# Altium schematic sheet medusa-AI-power.SchDoc
size A
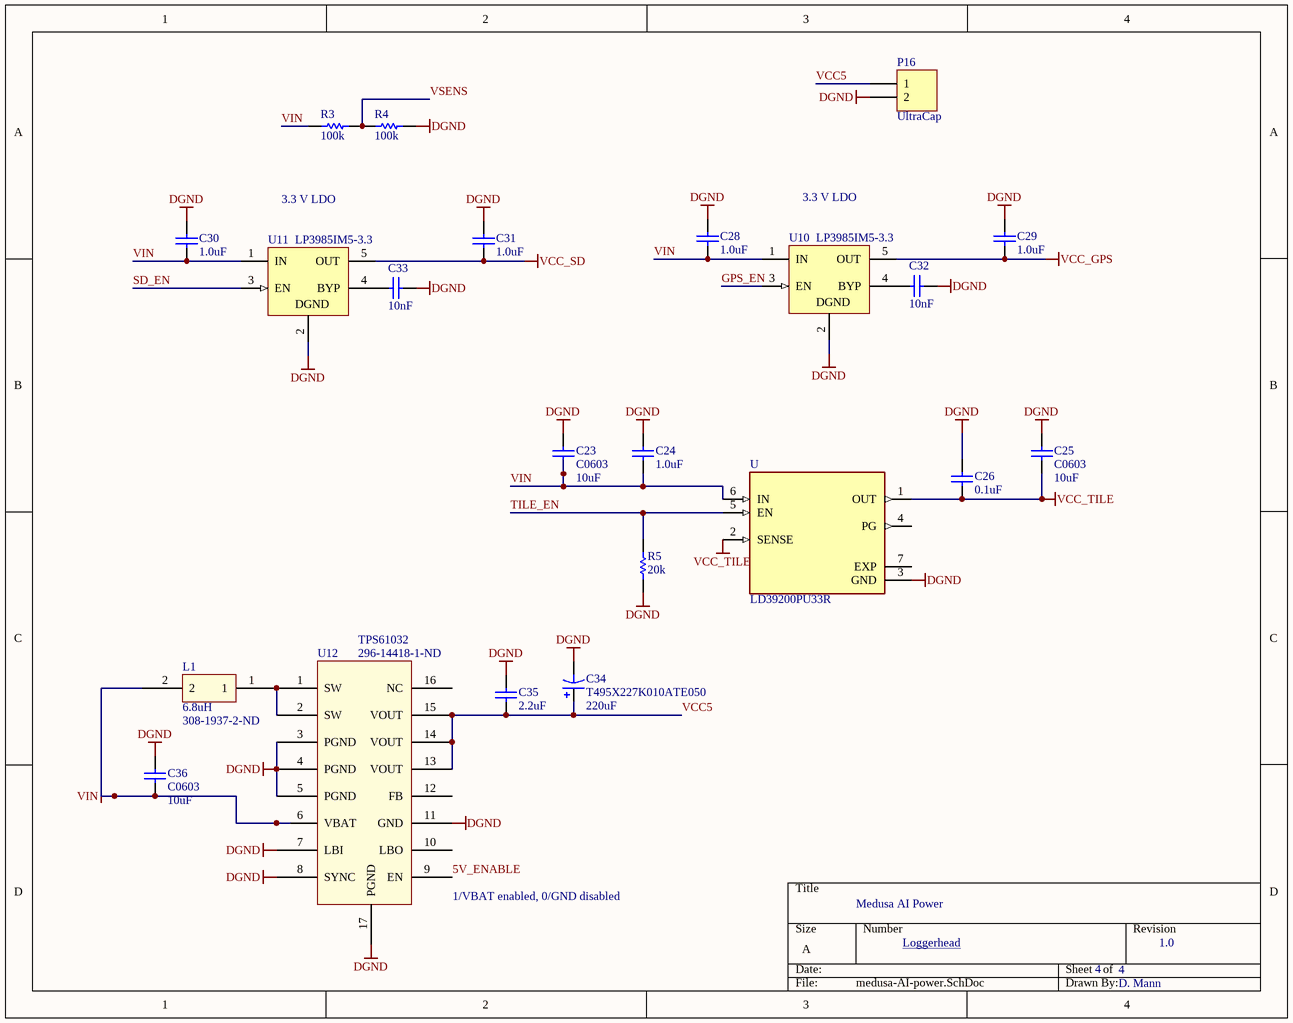
[diagram p0: medusa-AI-power.SchDoc]

## Parts
C23  C0603  value 10uF  [0603]
C24  1.0uF  [0402]
C25  C0603  value 10uF  [0603]
C26  0.1uF  [0402]
C28  1.0uF  [0402]
C29  1.0uF  [0402]
C30  1.0uF  [0402]
C31  1.0uF  [0402]
C32  10nF  [0402]
C33  10nF  [0402]
C34  T495X227K010ATE050  value 220uF  [X]
C35  2.2uF  [0402]
C36  C0603  value 10uF  [0603]
L1  6.8uH  Supplier Part Number 1: 308-1937-2-ND  [Inductor - duplicate]
P16  UltraCap  [HDR1X2]
R3  100k  [3-0603]
R4  100k  [3-0603]
R5  20k  [3-0603]
U  LD39200PU33R  [SON95P300X300X100-7N]
U10  LP3985IM5-3.3  [MF05A_N]
U11  LP3985IM5-3.3  [MF05A_N]
U12  TPS61032  Supplier Part Number 2: 296-14418-1-ND  [TPS6103x]

## Nets
DGND: C23.1 C24.2 C25.1 C26.2 C28.2 C29.2 C30.2 C31.2 C32.1 C33.1 C34.2 C35.2 C36.1 P16.2 R4.1 R5.2 U.3(GND) U10.2(GND) U11.2(GND) U12.3(PGND) U12.4(PGND) U12.5(PGND) U12.7(LBI) U12.8(SYNC) U12.11(GND) U12.17(PGND)
VCC_GPS: C29.1 U10.5(OUT)
VCC_SD: C31.1 U11.5(OUT)
VCC_TILE: C25.2 C26.1 U.1(OUT) U.2(SENSE)
VIN: C23.2 C24.1 C28.1 C30.1 C36.2 L1.2 R3.2 U.6(IN) U10.1(IN) U11.1(IN) U12.6(VBAT)
5V_ENABLE: U12.9(EN)
GPS_EN: U10.3(EN)
SD_EN: U11.3(EN)
TILE_EN: R5.1 U.5(EN)
VCC5: C34.1 C35.1 P16.1 U12.13(VOUT) U12.14(VOUT) U12.15(VOUT)
VSENS: R3.1 R4.2
NetC32_2: C32.2 U10.4(BYP)
NetC33_2: C33.2 U11.4(BYP)
NetL1_1: L1.1 U12.1(SW) U12.2(SW)

Not connected (* = marked no-connect by the designer): U 4(PG) 7(EXP); U12 10(LBO) 12(FB) 16(NC)

## Notes on the sheet
- 3.3 V LDO
- (near U12) 1/VBAT enabled, 0/GND disabled
- Medusa AI Power
- Loggerhead
- 4
- 1.0
- D. Mann
- (in symbol LP3985IM5-3.3) DGND

## Library data of the parts
C23 C25 C36 = C0603: Ceramic Chip Capacitor - Standard; Note: Footprint corresponds to dimensions for bulk cassette packaging. This case size has tightened tolerances.; Published: 17-Jul-2002; LatestRevisionDate: 19-Mar-2004; LatestRevisionNote: Silkscreen size reduced.; DatasheetDocument: Mar-2001; PackageDocument: Mar-2001; PackageReference: 0603; Publisher: Altium Limited; Code_JEITA: 0603; Code_IPC: 1608 [0603]; ComponentLink1Description: Manufacturer Link; ComponentLink1URL: http://www.kemet.com/; ComponentLink2Description: Datasheet; ComponentLink2URL: http://www.kemet.com/kemet/web/homepage/kechome.nsf/vapubfilesname/F3102TA.pdf/$file/F3102TA.pdf
C24 C28-C33 = C0402: Ceramic Chip Capacitor - Standard; Note: Footprint corresponds to dimensions for bulk cassette packaging. This case size has tightened tolerances.; Value: 0.1uF; Published: 17-Jul-2002; LatestRevisionDate: 19-Mar-2004; LatestRevisionNote: Silkscreen size reduced.; DatasheetDocument: Mar-2001; PackageDocument: Mar-2001; PackageReference: 0402; Publisher: Altium Limited; Code_JEITA: 0402; Code_IPC: 1005 [0402]; ComponentLink1Description: Manufacturer Link; ComponentLink1URL: http://www.kemet.com/; ComponentLink2Description: Datasheet; ComponentLink2URL: http://www.kemet.com/kemet/web/homepage/kechome.nsf/vapubfilesname/F3102TA.pdf/$file/F3102TA.pdf
C26 C35 = C0402: Ceramic Chip Capacitor - Standard; Note: Footprint corresponds to dimensions for bulk cassette packaging. This case size has tightened tolerances.; Published: 17-Jul-2002; LatestRevisionDate: 19-Mar-2004; LatestRevisionNote: Silkscreen size reduced.; DatasheetDocument: Mar-2001; PackageDocument: Mar-2001; PackageReference: 0402; Publisher: Altium Limited; Code_JEITA: 0402; Code_IPC: 1005 [0402]; ComponentLink1Description: Manufacturer Link; ComponentLink1URL: http://www.kemet.com/; ComponentLink2Description: Datasheet; ComponentLink2URL: http://www.kemet.com/kemet/web/homepage/kechome.nsf/vapubfilesname/F3102TA.pdf/$file/F3102TA.pdf
  C26: Value: 0.1uF
  C35: Value: 2.2uF
C34 = T495X: Solid Tantalum Chip Capacitor, Standard T495 Series - Low ESR, Surge Robust; PCB_Layout: Round Glue Pad at 2.9 ±0.1mm in diameter at KEMET's option; Published: 17-Jul-2002; LatestRevisionDate: 19-Mar-2004; LatestRevisionNote: Silkscreen dimensions re-sized.; DatasheetDocument: Mar-2001; PackageDocument: Mar-2001; PackageReference: X; Publisher: Altium Limited; Code_JEITA: 7343-43; ComponentLink1Description: Manufacturer Link; ComponentLink1URL: http://www.kemet.com/; ComponentLink2Description: Datasheet; ComponentLink2URL: http://www.kemet.com/kemet/web/homepage/kechome.nsf/vapubfilesname/F3102TA.pdf/$file/F3102TA.pdf
L1 = Inductor 6.8uH: Sumida Inductor; Supplier 1: Digi-Key
P16 = Header 2: Header, 2-Pin; LatestRevisionDate: 17-Jul-2002; LatestRevisionNote: Re-released for DXP Platform.; Publisher: Altium Limited
R3-R5 = ERJ3RK: Precision Thick Film Chip Resistor, 10 Ohm to 1M Ohm Range, 1% and 0.5% Tolerance, 0603 Size, 0.063 W; Published: 17-Dec-2003; LatestRevisionDate: 19-Mar-2004; LatestRevisionNote: Silkscreen size reduced.; PackageDocument: Mar-2003; PackageReference: 3-0603; Publisher: Altium Limited; Code_IPC: 1608 [0603]; ComponentLink1Description: Manufacturer Link; ComponentLink1URL: http://www.panasonic.com/industrial/components/resistive_products.htm; ComponentLink2Description: Datasheet; ComponentLink2URL: http://www.panasonic.com/industrial/components/pdf/AOA0000CE2.pdf
U = LD39200PU33R: Linear Voltage Regulator IC 1 Output 2A 6-DFN _3x3_; MF: STMicroelectronics; Package: DFN-6 STMicroelectronics; SnapEDA_Link: https://www.snapeda.com/parts/LD39200PU33R/STMicroelectronics/view-part/482679/?ref=snap; MP: LD39200PU33R; Value: *; Availability: Unavailable; Price: None
U10 U11 = LP3985IM5-3.3: Micropower, 150mA Low-Noise Ultra Low-Dropout CMOS Voltage Regulator; Manufacturer: National Semiconductor; CompType: LDO IC; PackageTopMarking: LDQB*XTT; PowerWise: N; Published: 4-Dec-2008; DatasheetVersion: Aug-2005; PackageVersion: revD, Aug-2008; PackageReference: MF05A; Publisher: Altium Limited; PackageDescription: Molded SOT-23, .115 x .063 x .040 in Body, 5 Lead, .0375 in Pitch; PartNumber: LP3985IM5-3.3; RoHS: O; PinCount: 5; DigiKeyPartNumber: LP3985IM5-3.3CT-ND; ComponentLink1Description: LP3985 Datasheet; ComponentLink1URL: http://www.national.com/ds/LP/LP3985.pdf; ComponentLink2Description: LP3985 Web Page; ComponentLink2URL: http://www.national.com/pf/LP/LP3985.html; ComponentLink3Description: MF05A Package Page; ComponentLink3URL: http://www.national.com/packaging/folders/mf05a.html
U12 = TPS6103x: Boost converter; Supplier 1: Newark; Supplier 2: Digi-Key